# Altium schematic sheet xc7z030_pwr.SchDoc
size A3
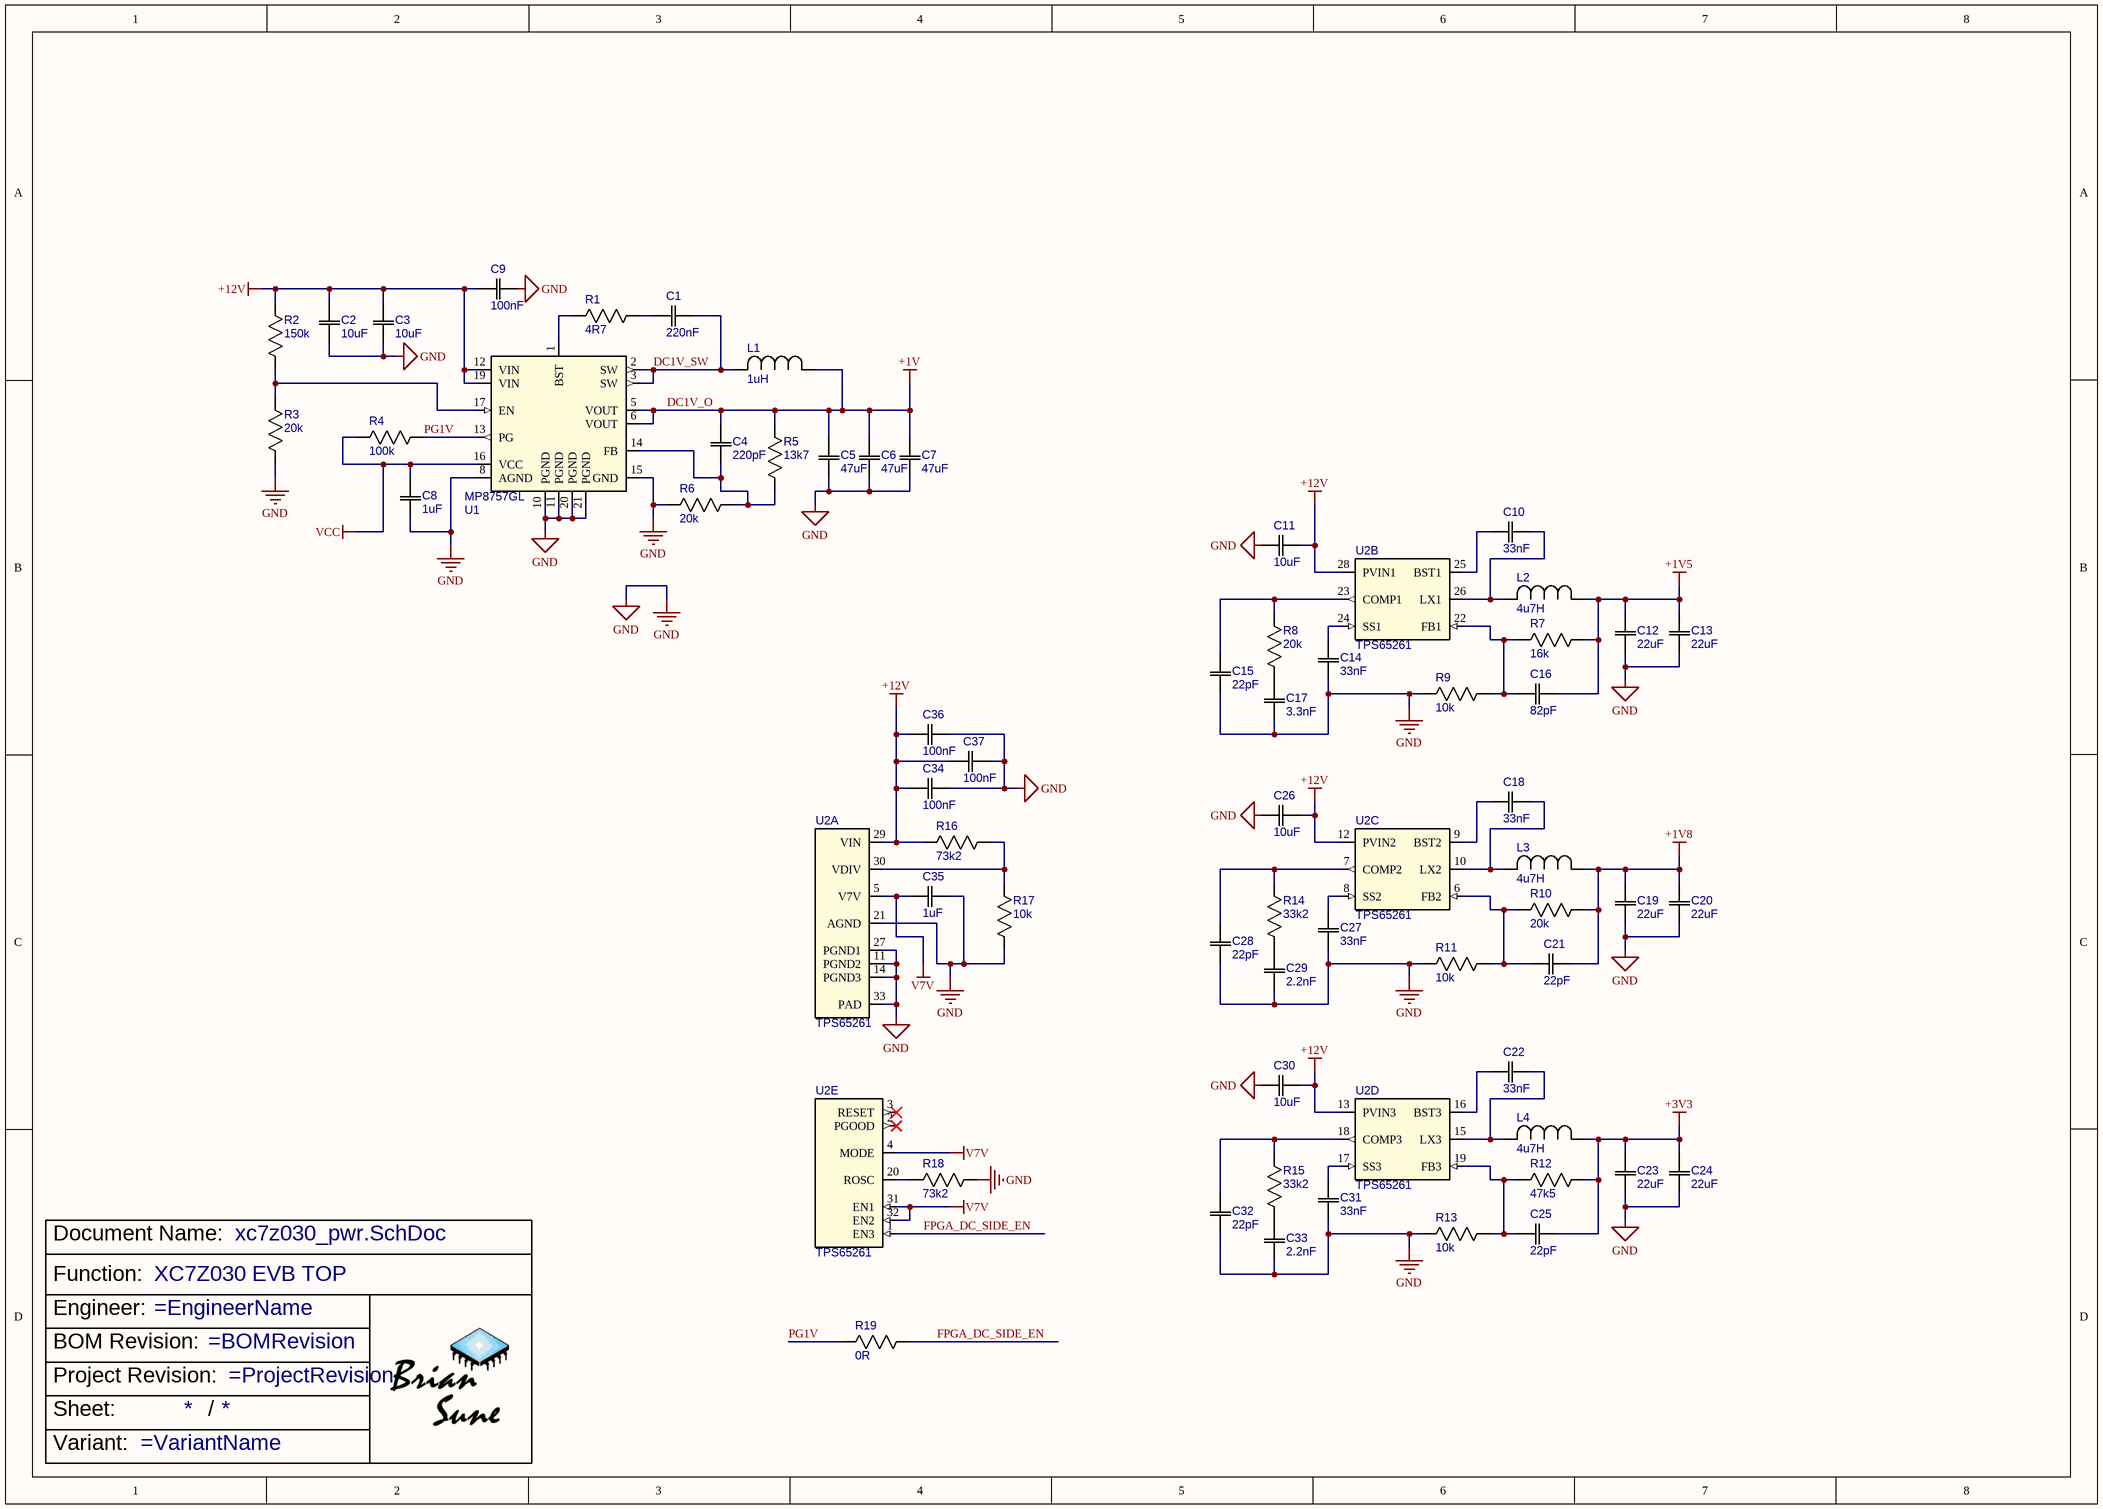
[diagram p0: xc7z030_pwr.SchDoc]

## Parts
?  Function: XC7Z030 EVB TOP  (hidden comment: TitleBlock)  (graphical)
C1  220nF  [0402]
C2  10uF  [C0603]
C3  10uF  [C0603]
C4  220pF  [0402]
C5  47uF  [C0603]
C6  47uF  [C0603]
C7  47uF  [C0603]
C8  1uF  [C0603]
C9  100nF  [0402]
C10  33nF  [0402]
C11  10uF  [C0603]
C12  22uF  [C0603]
C13  22uF  [C0603]
C14  33nF  [0402]
C15  22pF  [0402]
C16  82pF  [0402]
C17  3.3nF  [0402]
C18  33nF  [0402]
C19  22uF  [C0603]
C20  22uF  [C0603]
C21  22pF  [0402]
C22  33nF  [0402]
C23  22uF  [C0603]
C24  22uF  [C0603]
C25  22pF  [0402]
C26  10uF  [C0603]
C27  33nF  [0402]
C28  22pF  [0402]
C29  2.2nF  [0402]
C30  10uF  [C0603]
C31  33nF  [0402]
C32  22pF  [0402]
C33  2.2nF  [0402]
C34  100nF  [0402]
C35  1uF  [C0603]
C36  100nF  [0402]
C37  100nF  [0402]
L1  1uH  [0650SMD]
L2  4u7H  [04x0SMD_P]
L3  4u7H  [04x0SMD_P]
L4  4u7H  [04x0SMD_P]
R1  4R7  [0402]
R2  150k  [0402]
R3  20k  [0402]
R4  100k  [0402]
R5  13k7  [0402]
R6  20k  [0402]
R7  16k  [0402]
R8  20k  [0402]
R9  10k  [0402]
R10  20k  [0402]
R11  10k  [0402]
R12  47k5  [0402]
R13  10k  [0402]
R14  33k2  [0402]
R15  33k2  [0402]
R16  73k2  [0402]
R17  10k  [0402]
R18  73k2  [0402]
R19  0R  [0402]
U1  MP8757GL  [QFN21_3x4mm]
U2  TPS65261  [VQFN_1MM]  (parts A,B,C,D,E of 5)

## Nets
+1V5: C12.2 C13.2 C16.2 L2.1 R7.2
+1V8: C19.2 C20.2 C21.2 L3.1 R10.2
+3V3: C23.2 C24.2 C25.2 L4.1 R12.2
+12V: C2.2 C3.2 C9.2 C11.2 C26.2 C30.2 C34.1 C36.1 C37.1 R2.1 R16.1 U1.12(VIN) U1.19(VIN) U2.12(PVIN2) U2.13(PVIN3) U2.28(PVIN1) U2.29(VIN)
DC1V_O: C4.2 C5.2 C6.2 C7.2 L1.1 R5.2 U1.5(VOUT) U1.6(VOUT)  [also labelled +1V]
GND: C2.1 C3.1 C5.1 C6.1 C7.1 C8.1 C9.1 C11.1 C12.1 C13.1 C14.1 C15.1 C17.1 C19.1 C20.1 C23.1 C24.1 C26.1 C27.1 C28.1 C29.1 C30.1 C31.1 C32.1 C33.1 C34.2 C35.2 C36.2 C37.2 R3.1 R6.1 R9.1 R11.1 R13.1 R17.1 R18.2 U1.8(AGND) U1.10(PGND) U1.11(PGND) U1.15(GND) U1.20(PGND) U1.21(PGND) U2.11(PGND2) U2.14(PGND3) U2.21(AGND) U2.27(PGND1) U2.33(PAD)
V7V: C35.1 U2.4(MODE) U2.5(V7V) U2.31(EN1) U2.32(EN2)
VCC: C8.2 R4.1 U1.16(VCC)
DC1V_SW: C1.2 L1.2 U1.2(SW) U1.3(SW)
FPGA_DC_SIDE_EN: R19.2 U2.1(EN3)
PG1V: R4.2 R19.1 U1.13(PG)
NetC1_1: C1.1 R1.1
NetC4_1: C4.1 R5.1 R6.2 U1.14(FB)
NetC10_1: C10.1 U2.25(BST1)
NetC10_2: C10.2 L2.2 U2.26(LX1)
NetC14_2: C14.2 U2.24(SS1)
NetC15_2: C15.2 R8.2 U2.23(COMP1)
NetC16_1: C16.1 R7.1 R9.2 U2.22(FB1)
NetC17_2: C17.2 R8.1
NetC18_1: C18.1 U2.9(BST2)
NetC18_2: C18.2 L3.2 U2.10(LX2)
NetC21_1: C21.1 R10.1 R11.2 U2.6(FB2)
NetC22_1: C22.1 U2.16(BST3)
NetC22_2: C22.2 L4.2 U2.15(LX3)
NetC25_1: C25.1 R12.1 R13.2 U2.19(FB3)
NetC27_2: C27.2 U2.8(SS2)
NetC28_2: C28.2 R14.2 U2.7(COMP2)
NetC29_2: C29.2 R14.1
NetC31_2: C31.2 U2.17(SS3)
NetC32_2: C32.2 R15.2 U2.18(COMP3)
NetC33_2: C33.2 R15.1
NetR1_2: R1.2 U1.1(BST)
NetR2_2: R2.2 R3.2 U1.17(EN)
NetR16_2: R16.2 R17.2 U2.30(VDIV)
NetR18_1: R18.1 U2.20(ROSC)

Not connected (* = marked no-connect by the designer): U2 2(PGOOD)* 3(RESET)*

## Notes on the sheet
- (in symbol TitleBlock) Document Name:; Function:; Engineer:; BOM Revision:; Project Revision:; Sheet:; /; Variant:

## Library data of the parts
C1 = OBEIDUN_220nF: 0402 220nF 224K  50V X7R; ComponentLink1Description: taobao; ComponentLink1URL: https://detail.tmall.com/item.htm?abbucket=11&id=610639075445&rn=c45cf579a90ea6adc9060b093ff18dcd&skuId=4463795831944&spm=a312a.7700824.w4011-22147617817.53.51a47d1eimiUpx; Mfr.: OBEIDUN; Mfr. No: 224K; Price: 0.03
C2 C3 C11 C26 C30 = OUDEIBUN_10uF_50V: OUDEIBUN / 50V 10% 106K X5R; Mfr. No: 106; ComponentLink1Description: taobao; ComponentLink1URL: https://detail.tmall.com/item.htm?abbucket=11&id=610884231672&rn=bfecce7903ee26d41e055cbdf2d2e6eb&spm=a1z10.3-b.w4011-22147617817.28.ed547d1efUUngR&skuId=4463564134689; Mfr.: OUDEIBUN; Price: 0.2
C4 = OBEIDUN_220pF: OBEIDUN 0402 221J COG 50V; ComponentLink1Description: taobao; ComponentLink1URL: https://detail.tmall.com/item.htm?_u=l10quk0k03aa&id=608895064566&spm=a1z09.2.0.0.10c82e8dL5BzWq&skuId=4453182071791; Mfr.: OBEIDUN; Mfr. No: 221J; Price: 0.02
C5-C7 = OUDEIBUN_47uF_6V3: OUDEIBUN / 6V3 20% 476K X5R; Mfr. No: 476; ComponentLink1Description: taobao; ComponentLink1URL: https://detail.tmall.com/item.htm?abbucket=13&id=610150176421&rn=481b48c6c534cdc180661e2f6a596c7b&skuId=4296160929116&spm=a1z10.3-b.w4011-22147617817.57.14877d1eTKWJED; Mfr.: OUDEIBUN; Price: 0.3
C8 C35 = OUDEIBUN_1uF: 0603 1UF 16V 10% 105K X5R; ComponentLink1Description: taobao; ComponentLink1URL: https://detail.tmall.com/item.htm?abbucket=11&id=610883455002&rn=96f7b0dde361d4c3b62eb7ab1af2da05&skuId=4292434832790&spm=a1z10.3-b.w4011-22147617817.48.46817d1eD6aiZS; Mfr.: OUDEIBUN; Mfr. No: 105K; Price: 0.03
C9 C34 C36 C37 = OBEIDUN_100nF: 0402 100NF 104K  50V X7R; ComponentLink1Description: taobao; ComponentLink1URL: https://detail.tmall.com/item.htm?abbucket=11&id=610169377419&rn=af8cc3c313be083494688299e412f071&skuId=4460562122099&spm=a1z10.3-b.w4011-22147617817.47.43b27d1eVfSLTc; Mfr.: OBEIDUN; Mfr. No: 104K; Price: 0.03
C10 C14 C18 C22 C27 C31 = OBEIDUN_33nF: 0402 33nF 333K 16V X7R; ComponentLink1Description: taobao; ComponentLink1URL: https://detail.tmall.com/item.htm?abbucket=11&id=610643367827&rn=485ffb871bba3336ec56bdf6e40ebf1b&skuId=4293224337085&spm=a1z10.3-b.w4011-22147617817.69.91e77d1e9KkI7E; Mfr.: OBEIDUN; Mfr. No: 333K; Price: 0.03
C12 C13 C19 C20 C23 C24 = OUDEIBUN_22uF: OUDEIBUN / 25V 10% 226K X5R; Mfr. No: 226; ComponentLink1Description: taobao; ComponentLink1URL: https://detail.tmall.com/item.htm?abbucket=11&id=610150156146&rn=59afea97bc42016507be0d5449395d39&spm=a1z10.3-b.w4011-22147617817.29.2b4e7d1e4hXUjj&skuId=4292454384286; Mfr.: OUDEIBUN; Price: 0.6
C15 C21 C25 C28 C32 = OBEIDUN_22pF: 0402 22pF 50V 20J COG NPO; Mfr. No: 220J; ComponentLink1Description: taobao; ComponentLink1URL: https://detail.tmall.com/item.htm?abbucket=13&id=609430597564&rn=a1c8a15a7d6b2f90e38db74694a5b856&spm=a1z10.3-b.w4011-22147617817.40.15037d1etTZYEz&skuId=4280449596223; Mfr.: OBEIDUN; Price: 0.02
C16 = OBEIDUN_82pF: 82pF 50V 620J COG NPO; Mfr. No: 820J; ComponentLink1Description: taobao; ComponentLink1URL: https://detail.tmall.com/item.htm?abbucket=11&id=609672674869&rn=c1fa653a33d4336f9e9c3c352a7aff81&spm=a1z10.3-b.w4011-22147617817.32.3e3c7d1e2qr17J&skuId=4284174813108; Mfr.: OBEIDUN; Price: 0.02
C17 = RAINPOLE_3n3F: RAINPOLE 0402 3.3nF 5% 50V NPO; Mfr. No: 332J; ComponentLink1Description: taobao; ComponentLink1URL: https://detail.tmall.com/item.htm?abbucket=11&id=577480004200&rn=e81fc7a7675914d6e9f82eba46a12cbb&skuId=3986690931936&spm=a1z10.3-b-s.w4011-12364813249.37.6d9c1ed6XWLE9d; Mfr.: RAINPOLE; Price: 0.04
C29 C33 = RAINPOLE_2n2F: RAINPOLE 0402 2.2nF 5% 50V NPO; Mfr. No: 222J; ComponentLink1Description: taobao; ComponentLink1URL: https://detail.tmall.com/item.htm?abbucket=11&id=577480004200&rn=e81fc7a7675914d6e9f82eba46a12cbb&skuId=3986690931935&spm=a1z10.3-b-s.w4011-12364813249.37.6d9c1ed6XWLE9d; Mfr.: RAINPOLE; Price: 0.04
L1 = L0650_1UH: WHC0650 7*7*5MM 1R0 13A 6m5Ohm; Mfr.: Yiruisen; ComponentLink1Description: taobao; ComponentLink1URL: https://detail.tmall.com/item.htm?id=627357573507&spm=a1z0d.6639537/tb.1997196601.4.a32d7484NrXeB3&skuId=4625833335696; Mfr. No: WHC0650; Price: 0.27
L2-L4 = L0430_4u7H: 4.6mmx4.1mm (LxH) DCDC Inductor SMD; Mfr.: Yiruisen; Mfr. No: WNR4030_4R7; ComponentLink1Description: taobao; ComponentLink1URL: https://detail.tmall.com/item.htm?_u=210quk0k00bf&id=627418333252&spm=a1z09.2.0.0.414e2e8dD7jcDS&skuId=4626433327929; Price: 0.13
R1 = OUDEIBUN_4R7: OUDEIBUN / 4R7 1% 1/16W; ComponentLink1Description: taobao; ComponentLink1URL: https://detail.tmall.com/item.htm?abbucket=13&id=609078818699&rn=feeb7488c21e87fd67651ea25af79abc&spm=a1z10.3-b.w4011-22147617817.124.4d347d1eCJcv5w&skuId=4447048518756; Mfr.: OUDEIBUN; Mfr. No: 4R7; Price: 0.02
R2 = OUDEIBUN_150k: OUDEIBUN / 1% 150k; Mfr.: UNIOHM; ComponentLink1Description: taobao; ComponentLink1URL: https://detail.tmall.com/item.htm?abbucket=11&id=608928061564&rn=4c37b34fc9dccdc2648173b890fd7863&spm=a1z10.3-b.w4011-22147617817.39.76cf7d1eaF9LC8&skuId=4280827589226; Mfr. No: 150k; Price: 0.02
R3 R6 R8 R10 = OUDEIBUN_20k: OUDEIBUN / 20k 1% 1/16W; ComponentLink1Description: taobao; ComponentLink1URL: https://detail.tmall.com/item.htm?_u=310quk0k3cbb&id=656218957556&skuId=4912158475127&spm=a1z09.2.0.0.d5442e8dvaKsoM; Mfr.: OUDEIBUN; Mfr. No: 20k; Price: 0.02
R4 = OUDEIBUN_100k: OUDEIBUN / 1% 100k; Mfr.: UNIOHM; ComponentLink1Description: taobao; ComponentLink1URL: https://detail.tmall.com/item.htm?abbucket=11&id=608928061564&rn=6cabffb4bef601fc6d0198b0cb480a08&spm=a1z10.3-b.w4011-22147617817.51.20d47d1eFEZrXW&skuId=4280827589222; Mfr. No: 100k; Price: 0.02
R5 = OUDEIBUN_13k7: OUDEIBUN / 13k7 1% 1/16W; ComponentLink1Description: taobao; ComponentLink1URL: https://detail.tmall.com/item.htm?_u=o10quk0kf7a9&id=655765932456&spm=a1z09.2.0.0.570c2e8dmKgpe8; Mfr.: OUDEIBUN; Mfr. No: 13k7; Price: 0.02
R7 = OUDEIBUN_16k: OUDEIBUN / 16k 1% 1/16W; ComponentLink1Description: taobao; ComponentLink1URL: https://detail.tmall.com/item.htm?abbucket=11&id=608846861852&rn=f3906b9a9f5d35fbf311e7100197937b&spm=a1z10.3-b.w4011-22147617817.42.3a057d1eN8EQT2&skuId=4279728581761; Mfr.: OUDEIBUN; Mfr. No: 16k; Price: 0.02
R9 R11 R13 R17 = UNIOHM_10k: UNIOHM / 10K 1% 1/16W; ComponentLink1Description: taobao; ComponentLink1URL: https://item.taobao.com/item.htm?spm=a1z09.2.0.0.570c2e8dmKgpe8&id=525633713781&_u=o10quk0k26e8; Mfr.: UNIOHM; Mfr. No: 10k; Price: 0.012
R12 = OUDEIBUN_47k5: OUDEIBUN / 47k5 1% 1/16W; ComponentLink1Description: taobao; ComponentLink1URL: https://detail.tmall.com/item.htm?abbucket=11&id=655773044079&rn=97d9fd7d3e40aac3ec20e0e4bb97f2bb&skuId=4907496518276&spm=a1z10.3-b.w4011-22147617817.21.41507d1eL5RGRn; Mfr.: OUDEIBUN; Mfr. No: 47k5; Price: 0.02
R14 R15 = OUDEIBUN_33k2: OUDEIBUN / 33k2 1% 1/16W; ComponentLink1Description: taobao; ComponentLink1URL: https://detail.tmall.com/item.htm?_u=o10quk0kba15&id=656995123026&skuId=4912165283327&spm=a1z09.2.0.0.570c2e8dmKgpe8; Mfr.: OUDEIBUN; Mfr. No: 33k2; Price: 0.02
R16 R18 = OUDEIBUN_73k2: OUDEIBUN / 73k2 1% 1/16W; ComponentLink1Description: taobao; ComponentLink1URL: https://detail.tmall.com/item.htm?abbucket=13&id=655776124899&rn=8c2a12cdcc93de56183387e142bb2639&spm=a1z10.3-b.w4011-22147617817.19.2f467d1e18LPyu&skuId=4738672061254; Mfr.: OUDEIBUN; Mfr. No: 73k2; Price: 0.02
R19 = OUDEIBUN_0R: OUDEIBUN / 0R 1% 1/16W; ComponentLink1Description: taobao; ComponentLink1URL: https://detail.tmall.com/item.htm?abbucket=11&id=609078082053&rn=dd22835191e181ef543cf6f0827e8de3&spm=a1z10.3-b.w4011-22147617817.40.1e787d1eBkSpf5&skuId=4447040574382; Mfr.: OUDEIBUN; Mfr. No: 0R; Price: 0.02
U1 = MP8757GL: High Efficiency, 7A, 18V / Synchronous, Step-Down Converter; Mfr.: Monolithic Power Systems; Mfr. No: MP8757GL-Z; Price: 1.09; ComponentLink1Description: taobao; ComponentLink1URL: https://item.taobao.com/item.htm?id=769936282235&skuId=5276685344264&spm=a1z0d.6639537/tb.1997196601.14.a32d7484BS3swO
U2 = TPS65261RHBR: 4.5-V to 18-V Input Voltage, 3-A/2-A/2-A Output Current / Triple Synchronous Step-Down Converter; Mfr.: Texas Instruments Incorporated; Price: 4.4; Mfr. No: TPS65261RHBR; ComponentLink1Description: taobao; ComponentLink1URL: https://item.taobao.com/item.htm?spm=a1z0d.6639537/tb.1997196601.4.24877484nqp7mV&id=750148428314